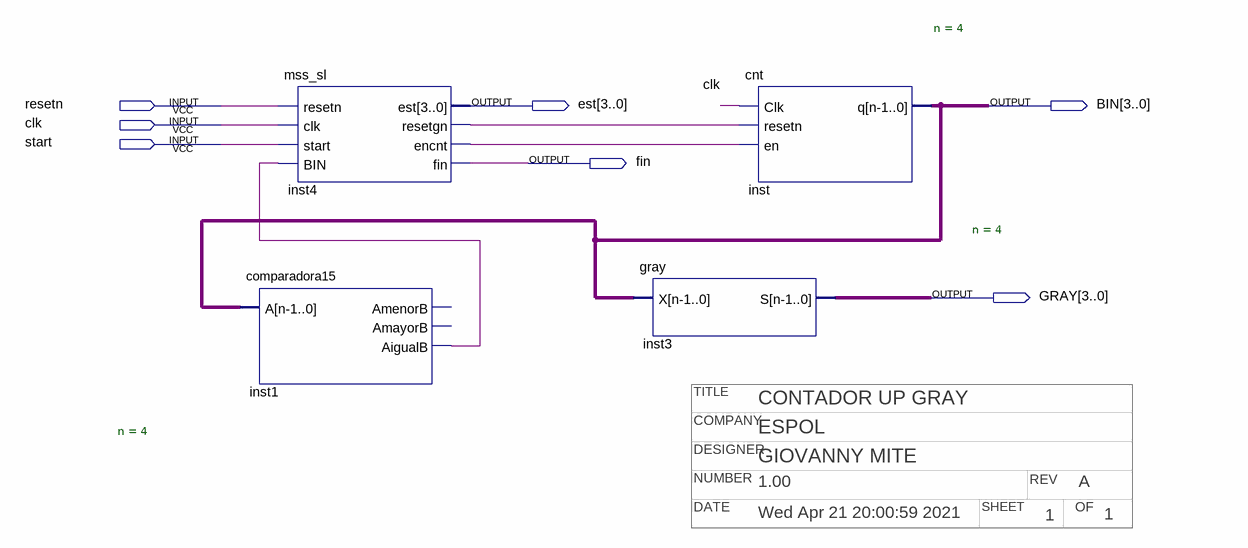
[diagram p0: schematic sheet]
// Quartus schematic contadorpr.bdf as structural Verilog: 4 symbols, 7 pins
// Title block: COMPANY: ESPOL; DATE: Wed Apr 21 20:00:59 2021; DESIGNER: GIOVANNY MITE; NUMBER: 1.00; OF: 1; REV: A; SHEET: 1; TITLE: CONTADOR UP GRAY
module contadorpr (
  input  resetn,
  input  clk,
  input  start,
  output [3:0] est,
  output [3:0] BIN,
  output fin,
  output [3:0] GRAY
);

  wire inst1_aigualb, inst4_encnt, inst4_resetgn;

  comparadora15 #(.n(4)) inst1 (.A(BIN), .AigualB(inst1_aigualb));  // open: AmenorB, AmayorB
  mss_sl inst4 (
    .resetn(resetn), .clk(clk), .start(start), .BIN(inst1_aigualb), .est(est), .resetgn(inst4_resetgn),
    .encnt(inst4_encnt), .fin(fin));
  gray #(.n(4)) inst3 (.X(BIN), .S(GRAY));
  cnt #(.n(4)) inst (.Clk(clk), .resetn(inst4_resetgn), .en(inst4_encnt), .q(BIN));
endmodule
